# Altium schematic sheet Lakota_PCB.SchDoc
size A
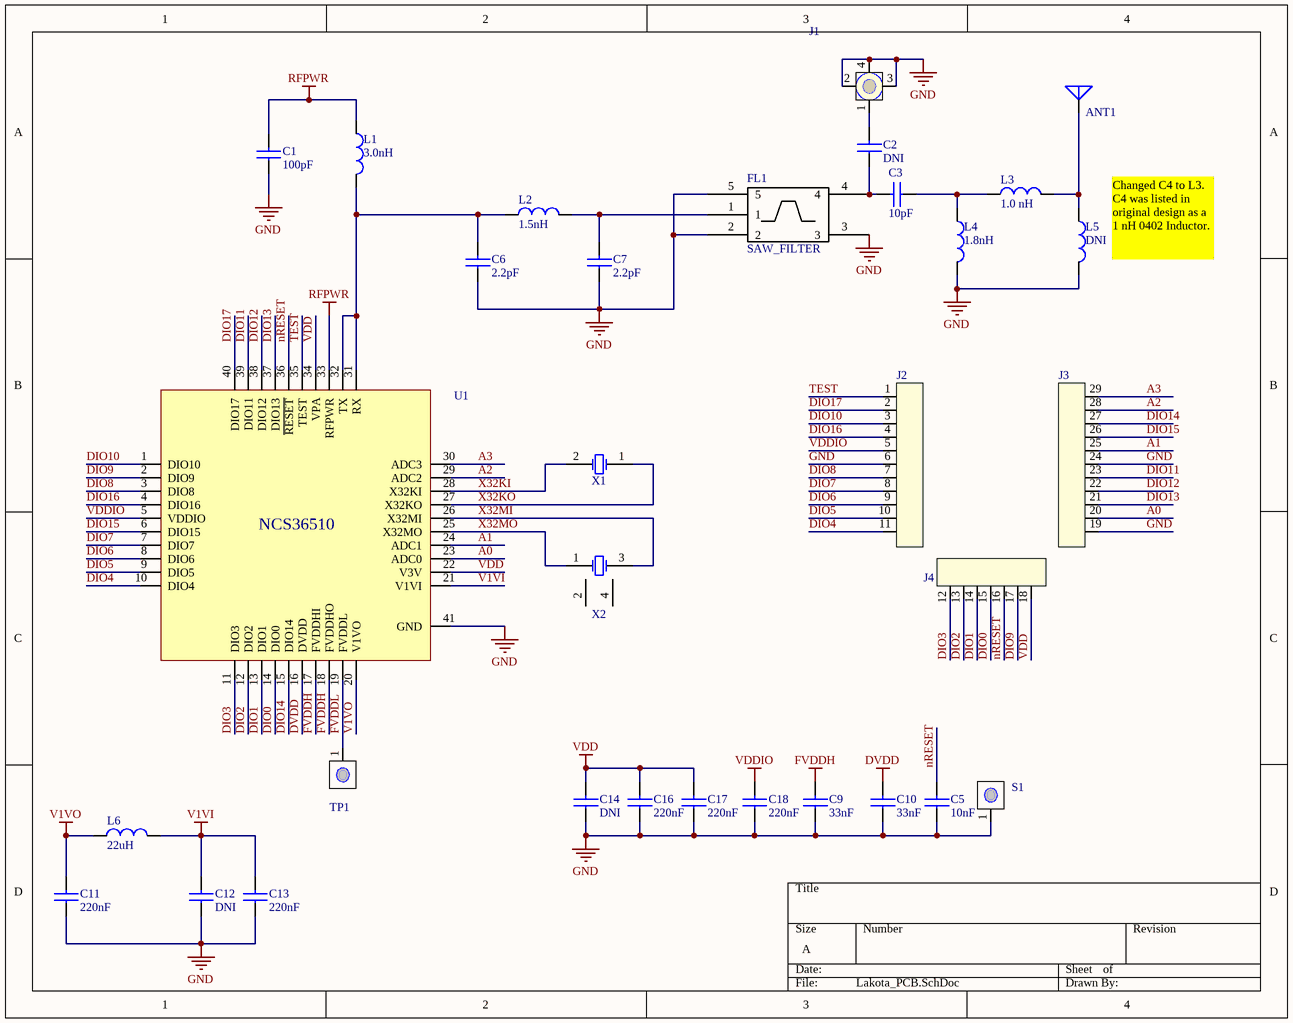
[diagram p0: Lakota_PCB.SchDoc]

## Parts
ANT1  ANTENNA_JOHANSON_2450AT42A100_S  [JOHANSON_2450AT42A100_SMD]  (value not drawn)
C1  value 100pF  [C_0402]  (hidden comment: CAPACITOR NON-POL_C_0402_100PF)
C2  value DNI  [C_0402_MOD1]  (hidden comment: CAPACITOR NON-POL_C_0402_MOD1_D)
C3  value 10pF  [C_0402_MOD1]  (hidden comment: CAPACITOR NON-POL_C_0402_MOD1_1)
C5  value 10nF  [C_0402]  (hidden comment: CAPACITOR NON-POL_C_0402_10NF)
C6  value 2.2pF  [C_0402]  (hidden comment: CAPACITOR NON-POL_C_0402_DNI)
C7  value 2.2pF  [C_0402]  (hidden comment: CAPACITOR NON-POL_C_0402_DNI)
C9  value 33nF  [C_0402]  (hidden comment: CAPACITOR NON-POL_C_0402_33NF)
C10  value 33nF  [C_0402]  (hidden comment: CAPACITOR NON-POL_C_0402_33NF)
C11  value 220nF  [C_0402]  (hidden comment: CAPACITOR NON-POL_C_0402_220NF)
C12  value DNI  [C_0402]  (hidden comment: CAPACITOR NON-POL_C_0402_220NF)
C13  value 220nF  [C_0402]  (hidden comment: CAPACITOR NON-POL_C_0402_DNI)
C14  value DNI  [C_0402]  (hidden comment: CAPACITOR NON-POL_C_0402_DNI)
C16  value 220nF  [C_0402]  (hidden comment: CAPACITOR NON-POL_C_0402_220NF)
C17  value 220nF  [C_0402]  (hidden comment: CAPACITOR NON-POL_C_0402_220NF)
C18  value 220nF  [C_0402]  (hidden comment: CAPACITOR NON-POL_C_0402_220NF)
FL1  SAW_FILTER  [SAW_FILTER]
J1  UFL_UFL_SMD_UFL  [UFL_SMD]  (value not drawn)
J2  CONN_1_27MM_PITCH_PIN_1_11_11X1  [11X1MM_BOT_PAD_1_TO_11_SMD]  (value not drawn)
J3  CONN_1_27MM_PITCH_PIN_19_29_11X  [11X1MM_BOT_PAD_19_TO_29_SMD]  (value not drawn)
J4  CONN_1_27MM_PITCH_PIN_12_18_7X1  [7X1MM_BOT_PAD_12_TO_18_SMD]  (value not drawn)
L1  value 3.0nH  [L_0402]  (hidden comment: INDUCTOR_L_0402_5.6NH)
L2  value 1.5nH  [L_0402]  (hidden comment: INDUCTOR_L_0402_0R)
L3  value 1.0 nH  [L_0402]  (hidden comment: CAPACITOR NON-POL_C_0402_0R)
L4  value 1.8nH  [L_0402]  (hidden comment: INDUCTOR_L_0402_DNI)
L5  value DNI  [L_0402]  (hidden comment: INDUCTOR_L_0402_DNI)
L6  value 22uH  [L_0603]  (hidden comment: INDUCTOR_L_0603_22UH)
S1  CON1_LAKOTA_SHIELD_SHIELD  [LAKOTA_SHIELD]  (value not drawn)
TP1  CON1_TP-30C12_CON1  [TP-30C12]  (value not drawn)
U1  NCS36510_NCS36510_NCS36510  [NCS36510]  (value not drawn)
X1  CRYSTAL2/SM_HOSONIC_ETDG_20X12_  [HOSONIC_ETDG_20X12_SMD]  (value not drawn)
X2  CRYSTAL4/SM_HOSONIC_2SB_250X200  [HOSONIC_2SB_250X200_SMD]  (value not drawn)

## Nets
DVDD: C10.2 U1.16(DVDD)
FVDDH: C9.2 U1.17(FVDDHI) U1.18(FVDDHO)
GND: C1.1 C5.1 C6.2 C7.2 C9.1 C10.1 C11.1 C12.1 C13.1 C14.1 C16.1 C17.1 C18.1 FL1.2 FL1.3 FL1.5 J1.2 J1.3 J1.4 J2.6 J3.19 J3.24 L4.2 L5.2 S1.1 U1.41(GND)
RFPWR: C1.2 L1.1 U1.33(RFPWR)
V1VI: C12.2 C13.2 L6.2 U1.21(V1VI)
V1VO: C11.2 L6.1 U1.20(V1VO)
VDD: C14.2 C16.2 C17.2 J4.18 U1.22(V3V) U1.34(VPA)
VDDIO: C18.2 J2.5 U1.5(VDDIO)
A0: J3.20 U1.23(ADC0)
A1: J3.25 U1.24(ADC1)
A2: J3.28 U1.29(ADC2)
A3: J3.29 U1.30(ADC3)
DIO0: J4.15 U1.14(DIO0)
DIO1: J4.14 U1.13(DIO1)
DIO2: J4.13 U1.12(DIO2)
DIO3: J4.12 U1.11(DIO3)
DIO4: J2.11 U1.10(DIO4)
DIO5: J2.10 U1.9(DIO5)
DIO6: J2.9 U1.8(DIO6)
DIO7: J2.8 U1.7(DIO7)
DIO8: J2.7 U1.3(DIO8)
DIO9: J4.17 U1.2(DIO9)
DIO10: J2.3 U1.1(DIO10)
DIO11: J3.23 U1.39(DIO11)
DIO12: J3.22 U1.38(DIO12)
DIO13: J3.21 U1.37(DIO13)
DIO14: J3.27 U1.15(DIO14)
DIO15: J3.26 U1.6(DIO15)
DIO16: J2.4 U1.4(DIO16)
DIO17: J2.2 U1.40(DIO17)
FVDDL: TP1.1 U1.19(FVDDL)
nRESET: C5.2 J4.16 U1.36(~{RESET})
TEST: J2.1 U1.35(TEST)
X32KI: U1.28(X32KI) X1.2(OSC2)
X32KO: U1.27(X32KO) X1.1(OSC1)
X32MI: U1.26(X32MI) X2.3
X32MO: U1.25(X32MO) X2.1(OSC1)
NetANT1_1: ANT1.1 L3.1 L5.1
NetC2_1: C2.1 J1.1
NetC2_2: C2.2 C3.1 FL1.4
NetC3_2: C3.2 L3.2 L4.1
NetC6_1: C6.1 L1.2 L2.1 U1.31(RX) U1.32(TX)
NetC7_1: C7.1 FL1.1 L2.2

Not connected (* = marked no-connect by the designer): X2 2(OSC2) 4(OSC4)

## Notes on the sheet
- (near L5) Changed C4 to L3.  C4 was listed in original design as a 1 nH 0402 Inductor.

## Library data of the parts
ANT1 = ANTENNA_0
C1-C3 C5-C7 C9-C14 C16-C18 = CAPACITOR_NP
FL1 = SAW_FILTER: SAW Filter
J1 = CONN_UFL
J2 = CONN_1_27mm_pitch_pin_1_11
J3 = CONN_1_27mm_pitch_pin_19_29
J4 = CONN_1_27mm_pitch_pin_12_18
L1-L6 = INDUCTOR
S1 = SHIELD
TP1 = TESTPOINT
U1 = NCS36510
X1 = XTAL: Crystal Oscillator
X2 = XTAL_4pin: Crystal Oscillator